# Altium schematic sheet LPCB235 - MAGNETICS.SchDoc
size A3; Address1: Unit 4; DocumentNumber: 23; Revision: 2; SheetNumber: 23; SheetTotal: 37; Lockie__PCB_SUB_ASSEMBLY: Magnetics; Lockie__PCB_ASSEMBLY: FCU PCB; Lockie__LDL: LPCB235; Lockie__PCB_DESCRIPTION: Flight Control Unit
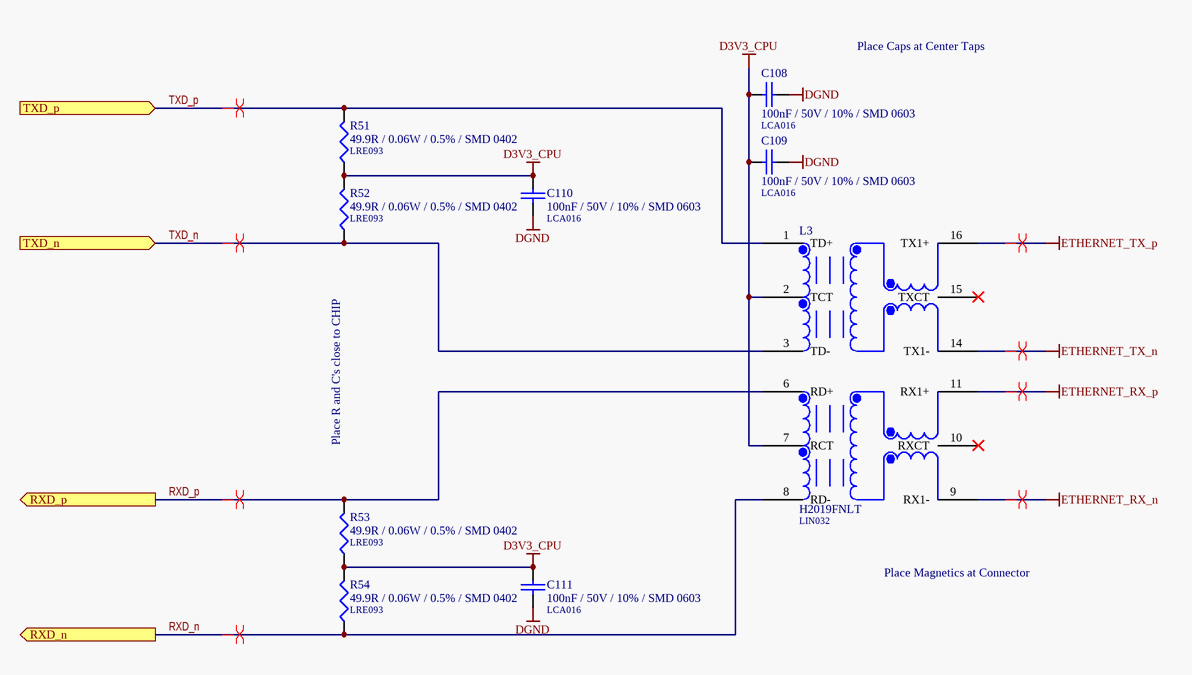
[diagram p0: LPCB235 - MAGNETICS.SchDoc]

## Parts
C108  100nF / 50V / 10% / SMD 0603  LDL_NUMBER: LCA016  [LFP011__CC1608-0603-IPC7351_B]
C109  100nF / 50V / 10% / SMD 0603  LDL_NUMBER: LCA016  [LFP011__CC1608-0603-IPC7351_B]
C110  100nF / 50V / 10% / SMD 0603  LDL_NUMBER: LCA016  [LFP011__CC1608-0603-IPC7351_B]
C111  100nF / 50V / 10% / SMD 0603  LDL_NUMBER: LCA016  [LFP011__CC1608-0603-IPC7351_B]
L3  H2019FNLT  LDL_NUMBER: LIN032  [LFP076__H2019NL]
R51  49.9R / 0.06W / 0.5% / SMD 0402  LDL_NUMBER: LRE093  [LFP030__CR1005-0402-IPC7351]
R52  49.9R / 0.06W / 0.5% / SMD 0402  LDL_NUMBER: LRE093  [LFP030__CR1005-0402-IPC7351]
R53  49.9R / 0.06W / 0.5% / SMD 0402  LDL_NUMBER: LRE093  [LFP030__CR1005-0402-IPC7351]
R54  49.9R / 0.06W / 0.5% / SMD 0402  LDL_NUMBER: LRE093  [LFP030__CR1005-0402-IPC7351]

## Ports
RXD_n (out), RXD_p (out), TXD_n (in), TXD_p (in)

## Nets
D3V3_CPU: C108.1 C109.1 C110.1 C111.1 L3.2(TCT) L3.7(RCT) R51.1 R52.2 R53.1 R54.2
DGND: C108.2 C109.2 C110.2 C111.2
ETHERNET_RX_n: L3.9(RX1-)
ETHERNET_RX_p: L3.11(RX1+)
ETHERNET_TX_n: L3.14(TX1-)
ETHERNET_TX_p: L3.16(TX1+)
RXD_n: L3.8(RD-) R54.1 ; port RXD_n
RXD_p: L3.6(RD+) R53.2 ; port RXD_p
TXD_n: L3.3(TD-) R52.1 ; port TXD_n
TXD_p: L3.1(TD+) R51.2 ; port TXD_p

Not connected (* = marked no-connect by the designer): L3 10(RXCT)* 15(TXCT)*

## Layout directives
differential pair: ETHERNET_RX_n, ETHERNET_RX_p, ETHERNET_TX_n, ETHERNET_TX_p, RXD_n, RXD_p, TXD_n, TXD_p

## Notes on the sheet
- Place Caps at Center Taps
- (near R52) Place R and C's close to CHIP
- Place Magnetics at Connector
- PCB COMPONENT DESCRIPTION
- LDL NUMBER
- Assembly Details
- Size
- Drawing File Name
- Revision
- http://rloop.org
- Scale
- A3
- Sheet Details
- N.T.S
- Sheet:
- Of:

## Library data of the parts
C108-C111 = 100nF / 50V / 10% / SMD 0603: Capacitor, Ceramic Chip, 100nF (0.1uF), 50V, 5%, SMD 0603 [LCA016]; Value: 100n; FMEDA__OPERATING__TEMP_MAX: 50; FMEDA__OPERATING__TEMP_MIN: -20; FMEDA__OPERATING__TEMP_TYP: 27; FMEDA__OPERATING__VOLTAGE_MAX: 3.3; FMEDA__OPERATING__VOLTAGE_MIN: 0; FMEDA__CHANNEL: COM; FMEDA__FUNCTION_IN_SYSTEM: *; FMEDA__OPERATING__VOLTAGE_TYP: 3.3
L3 = H2019FNLT: Transformer, Signal Transformers, SMD [LIN032]; FMEDA__OPERATING__TEMP_MAX: 50; FMEDA__OPERATING__TEMP_MIN: -20; FMEDA__OPERATING__TEMP_TYP: 27; FMEDA__CHANNEL: COM; Revision: July-2002: Re-released for DXP Platform.; FMEDA__FUNCTION_IN_SYSTEM: *
R51-R54 = 49.9R / 0.06W / 0.5% / SMD 0402: Resistor, Ceramic Chip, 49.9R, 0.0625W, 0.5%, SMD 0402 [LRE093]; Value: 49.9; FMEDA__OPERATING__POWER_MAX: 0; FMEDA__OPERATING__TEMP_MAX: 50; FMEDA__OPERATING__TEMP_MIN: -20; FMEDA__OPERATING__TEMP_TYP: 27; FMEDA__CHANNEL: COM; FMEDA__OPERATING__POWER_MIN: 0; FMEDA__OPERATING__VOLTAGE_MAX: 0; FMEDA__OPERATING__VOLTAGE_MIN: 0; FMEDA__OPERATING__VOLTAGE_TYP: 0